# Altium schematic sheet dental-unit-button v1_0.SchDoc
size 840 x 594 mm
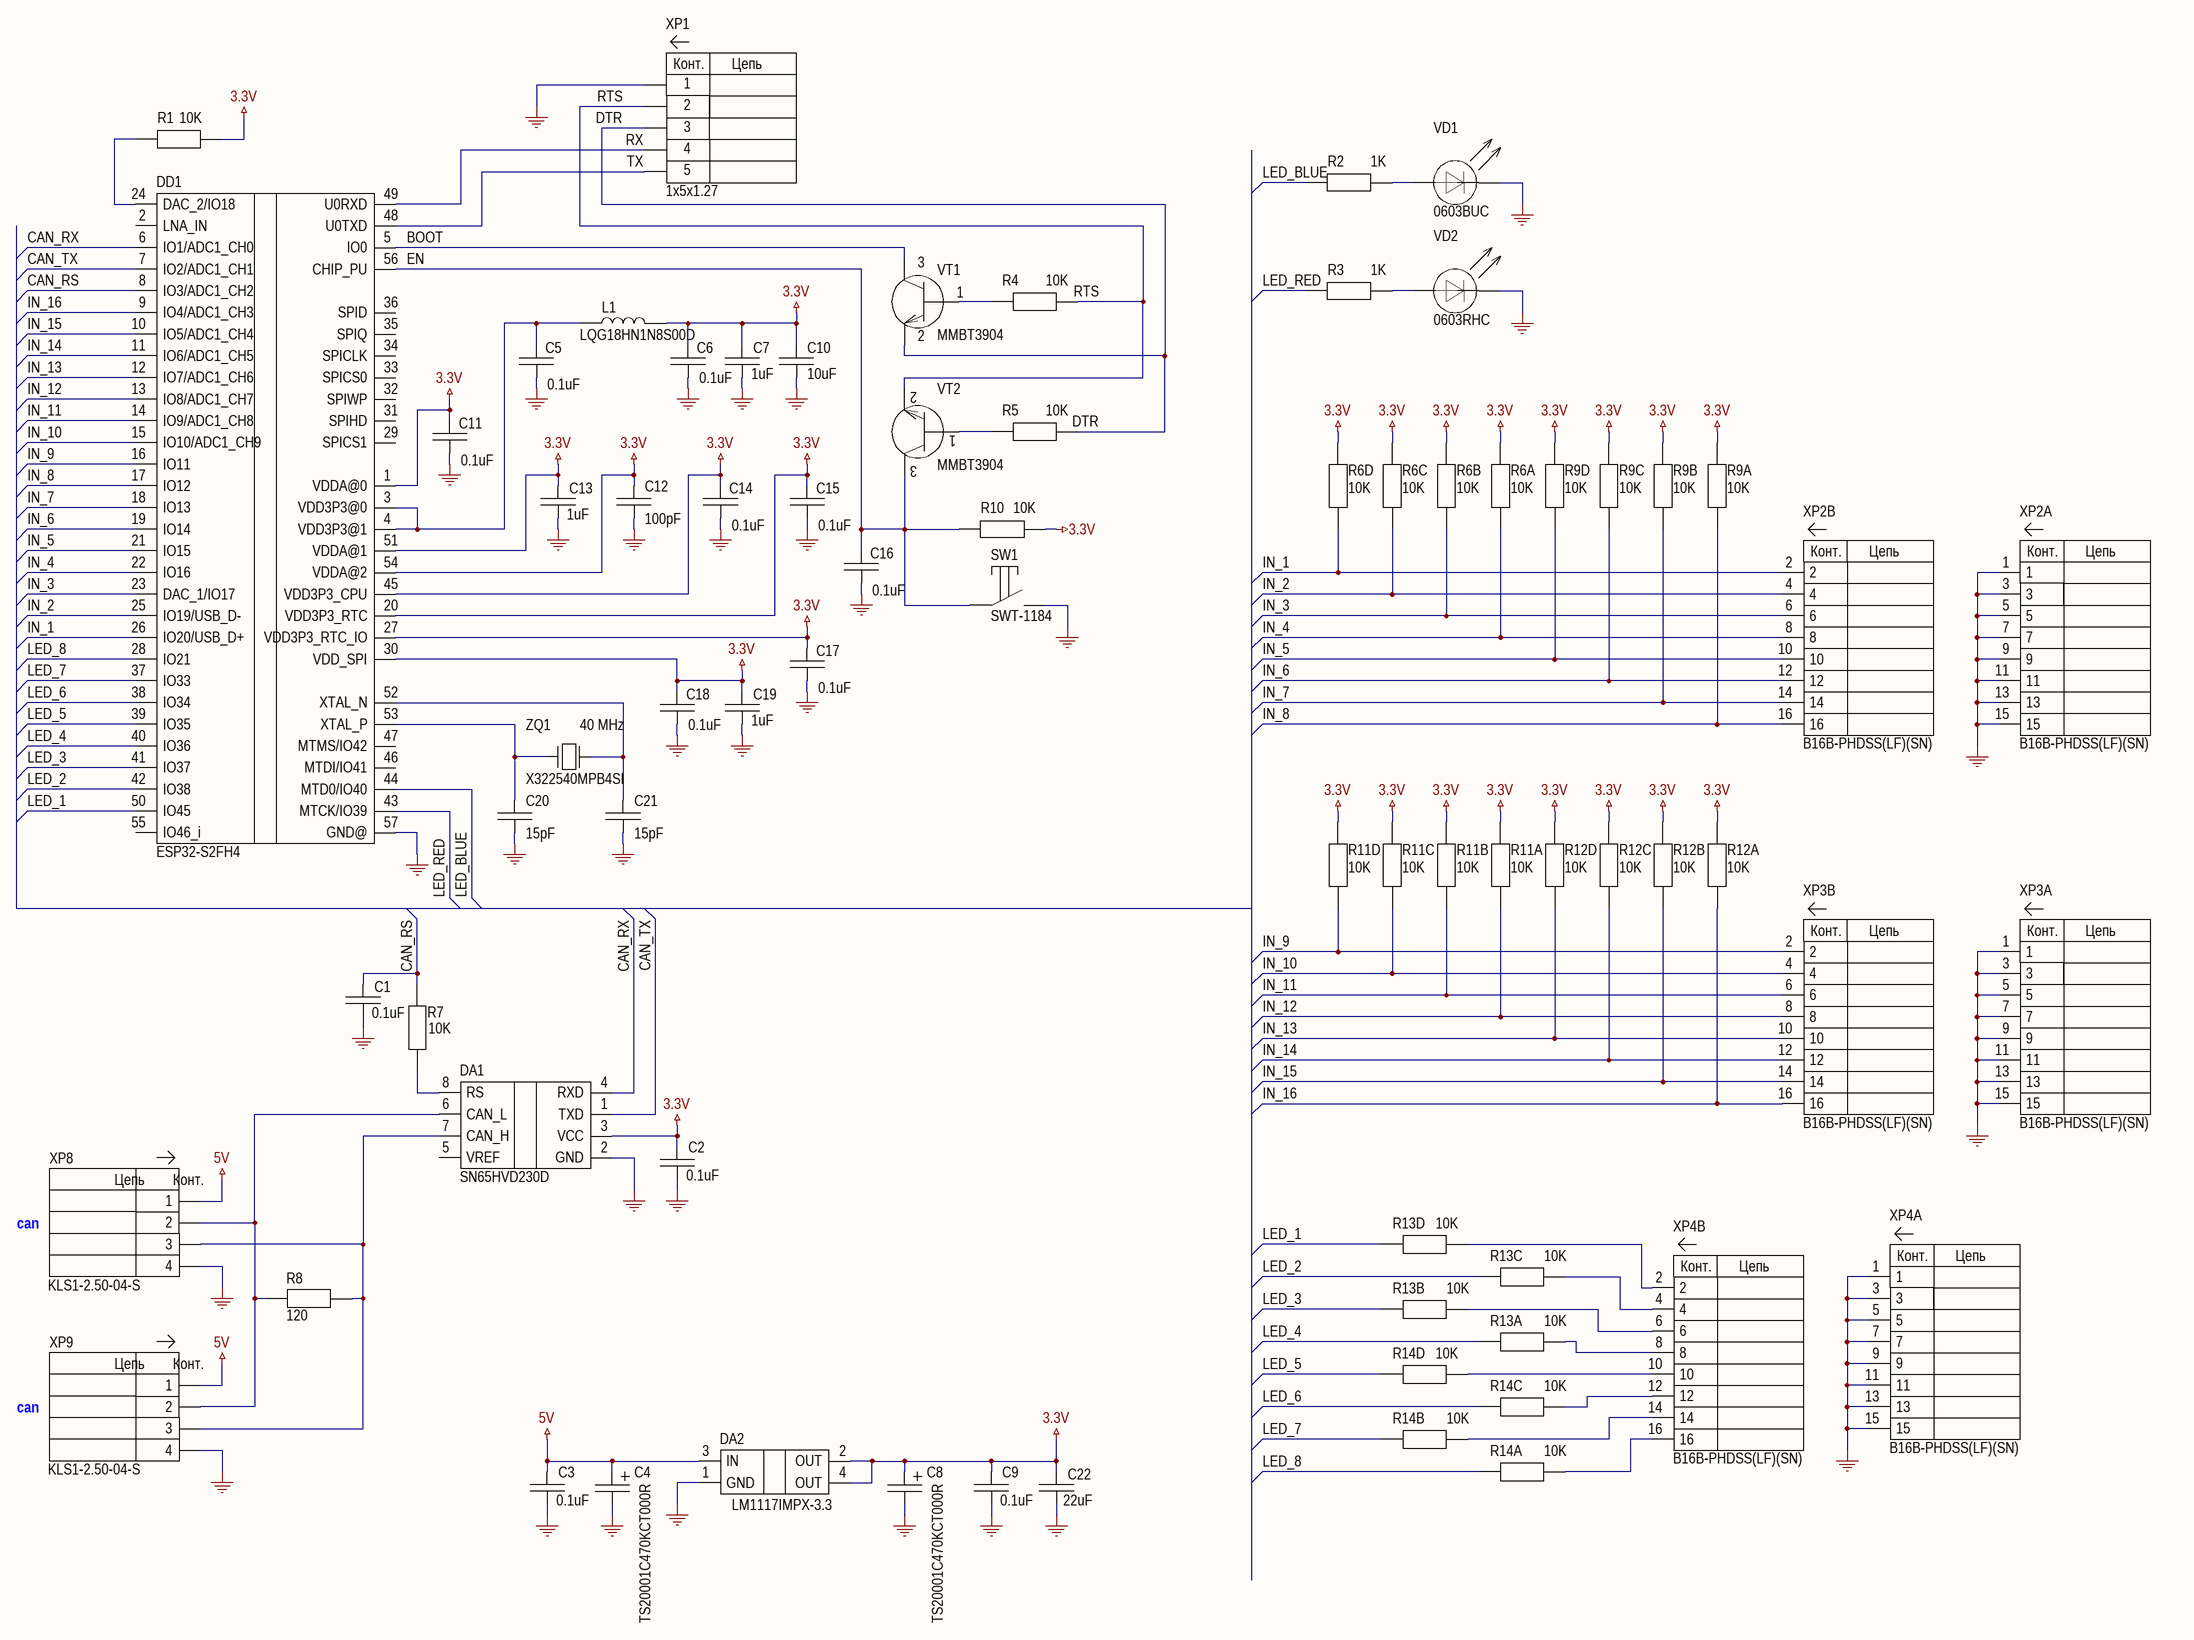
[diagram p0: dental-unit-button v1_0.SchDoc]

## Parts
C1  value 0.1uF  [CC_0603]  (hidden comment: CC0603KRX7R5BB104)
C2  value 0.1uF  [CC_0603]  (hidden comment: CC0603KRX7R5BB104)
C3  value 0.1uF  [CC_0603]  (hidden comment: CC0603KRX7R5BB104)
C4  TS20001C470KCT000R  [CC_TANT_C]
C5  value 0.1uF  [CC_0603]  (hidden comment: CC0603KRX7R5BB104)
C6  value 0.1uF  [CC_0603]  (hidden comment: CC0603KRX7R5BB104)
C7  value 1uF  [CC_0603]  (hidden comment: CL10A105KB8NNNC)
C8  TS20001C470KCT000R  [CC_TANT_C]
C9  value 0.1uF  [CC_0603]  (hidden comment: CC0603KRX7R5BB104)
C10  value 10uF  [CC_0603]  (hidden comment: CL10A106KP8NNNC)
C11  value 0.1uF  [CC_0603]  (hidden comment: CC0603KRX7R5BB104)
C12  value 100pF  [CC_0603]  (hidden comment: CC0603FRNPO9BN101)
C13  value 1uF  [CC_0603]  (hidden comment: CL10A105KB8NNNC)
C14  value 0.1uF  [CC_0603]  (hidden comment: CC0603KRX7R5BB104)
C15  value 0.1uF  [CC_0603]  (hidden comment: CC0603KRX7R5BB104)
C16  value 0.1uF  [CC_0603]  (hidden comment: CC0603KRX7R5BB104)
C17  value 0.1uF  [CC_0603]  (hidden comment: CC0603KRX7R5BB104)
C18  value 0.1uF  [CC_0603]  (hidden comment: CC0603KRX7R5BB104)
C19  value 1uF  [CC_0603]  (hidden comment: CL10A105KB8NNNC)
C20  value 15pF  [CC_0603]  (hidden comment: CC0603GPNPO9BN150)
C21  value 15pF  [CC_0603]  (hidden comment: CC0603GPNPO9BN150)
C22  value 22uF  [CC_0805]  (hidden comment: GRM21BR60J226ME39L)
DA1  SN65HVD230D  [SOIC-8]
DA2  LM1117IMPX-3.3  [SOT-223]
DD1  ESP32-S2FH4  [QFN40P700X700X90-57T400N]
L1  LQG18HN1N8S00D  [IC_0603]
R1  value 10K  [RC_0603]  (hidden comment: AC0603FR-0710KL)
R2  value 1K  [RC_0603]  (hidden comment: AC0603FR-071KL)
R3  value 1K  [RC_0603]  (hidden comment: AC0603FR-071KL)
R4  value 10K  [RC_0603]  (hidden comment: AC0603FR-0710KL)
R5  value 10K  [RC_0603]  (hidden comment: AC0603FR-0710KL)
R6  value 10K  [RC_0603x4]  (hidden comment: YC164-JR-0710KL)  (parts A,B,C,D of 4)
R7  value 10K  [RC_0603]  (hidden comment: AC0603FR-0710KL)
R8  value 120  [RC_0603]  (hidden comment: RC0603FR-07120RL)
R9  value 10K  [RC_0603x4]  (hidden comment: YC164-JR-0710KL)  (parts A,B,C,D of 4)
R10  value 10K  [RC_0603]  (hidden comment: AC0603FR-0710KL)
R11  value 10K  [RC_0603x4]  (hidden comment: YC164-JR-0710KL)  (parts A,B,C,D of 4)
R12  value 10K  [RC_0603x4]  (hidden comment: YC164-JR-0710KL)  (parts A,B,C,D of 4)
R13  value 10K  [RC_0603x4]  (hidden comment: YC164-JR-0710KL)  (parts A,B,C,D of 4)
R14  value 10K  [RC_0603x4]  (hidden comment: YC164-JR-0710KL)  (parts A,B,C,D of 4)
SW1  SWT-1184  [IT-1184]
VD1  0603BUC  [LED_0603]
VD2  0603RHC  [LED_0603]
VT1  MMBT3904  [SOT-23-3]
VT2  MMBT3904  [SOT-23-3]
XP1  1x5x1.27  [XT_1x5x1.27_offset]
XP2  B16B-PHDSS(LF)(SN)  [B16B-PHDSS]  (parts A,B of 2)
XP3  B16B-PHDSS(LF)(SN)  [B16B-PHDSS]  (parts A,B of 2)
XP4  B16B-PHDSS(LF)(SN)  [B16B-PHDSS]  (parts A,B of 2)
XP8  KLS1-2.50-04-S  name: can  [KLS1-2.50-04-S]
XP9  KLS1-2.50-04-S  name: can  [KLS1-2.50-04-S]
ZQ1  X322540MPB4SI  value 40 MHz  [OSC: 3225]

## Nets
3.3V: C2.2 C6.2 C7.2 C8.1 C9.2 C10.2 C11.2 C12.2 C13.2 C14.2 C15.2 C17.2 C18.2 C19.2 C22.2 DA1.3(VCC) DA2.2(OUT) DA2.4(OUT) DD1.1(VDDA@0) DD1.20(VDD3P3_RTC) DD1.27(VDD3P3_RTC_IO) DD1.30(VDD_SPI) DD1.45(VDD3P3_CPU) DD1.51(VDDA@1) DD1.54(VDDA@2) L1.2 R1.2 R6.5 R6.6 R6.7 R6.8 R9.5 R9.6 R9.7 R9.8 R10.2 R11.5 R11.6 R11.7 R11.8 R12.5 R12.6 R12.7 R12.8
5V: C3.2 C4.1 DA2.3(IN) XP8.1 XP9.1
GND: C1.1 C2.1 C3.1 C4.2 C5.1 C6.1 C7.1 C8.2 C9.1 C10.1 C11.1 C12.1 C13.1 C14.1 C15.1 C16.1 C17.1 C18.1 C19.1 C20.1 C21.1 C22.1 DA1.2(GND) DA2.1(GND) DD1.57(GND@) SW1.2 VD1.2(C) VD2.2(C) XP1.1 XP2.1 XP2.3 XP2.5 XP2.7 XP2.9 XP2.11 XP2.13 XP2.15 XP3.1 XP3.3 XP3.5 XP3.7 XP3.9 XP3.11 XP3.13 XP3.15 XP4.1 XP4.3 XP4.5 XP4.7 XP4.9 XP4.11 XP4.13 XP4.15 XP8.4 XP9.4
BOOT: DD1.5(IO0) VT1.3(C)
CAN_RS: C1.2 DD1.8(IO3/ADC1_CH2) R7.2
CAN_RX: DA1.4(RXD) DD1.6(IO1/ADC1_CH0)
CAN_TX: DA1.1(TXD) DD1.7(IO2/ADC1_CH1)
DTR: R5.2 VT1.2(E) XP1.3
EN: C16.2 DD1.56(CHIP_PU) R10.1 SW1.1 VT2.3(C)
IN_1: DD1.26(IO20/USB_D+) R6.4 XP2.2
IN_2: DD1.25(IO19/USB_D-) R6.3 XP2.4
IN_3: DD1.23(DAC_1/IO17) R6.2 XP2.6
IN_4: DD1.22(IO16) R6.1 XP2.8
IN_5: DD1.21(IO15) R9.4 XP2.10
IN_6: DD1.19(IO14) R9.3 XP2.12
IN_7: DD1.18(IO13) R9.2 XP2.14
IN_8: DD1.17(IO12) R9.1 XP2.16
IN_9: DD1.16(IO11) R11.4 XP3.2
IN_10: DD1.15(IO10/ADC1_CH9) R11.3 XP3.4
IN_11: DD1.14(IO9/ADC1_CH8) R11.2 XP3.6
IN_12: DD1.13(IO8/ADC1_CH7) R11.1 XP3.8
IN_13: DD1.12(IO7/ADC1_CH6) R12.4 XP3.10
IN_14: DD1.11(IO6/ADC1_CH5) R12.3 XP3.12
IN_15: DD1.10(IO5/ADC1_CH4) R12.2 XP3.14
IN_16: DD1.9(IO4/ADC1_CH3) R12.1 XP3.16
LED_1: DD1.50(IO45) R13.5
LED_2: DD1.42(IO38) R13.6
LED_3: DD1.41(IO37) R13.7
LED_4: DD1.40(IO36) R13.8
LED_5: DD1.39(IO35) R14.5
LED_6: DD1.38(IO34) R14.6
LED_7: DD1.37(IO33) R14.7
LED_8: DD1.28(IO21) R14.8
LED_BLUE: DD1.44(MTD0/IO40) R2.1
LED_RED: DD1.43(MTCK/IO39) R3.1
RTS: R4.2 VT2.2(E) XP1.2
RX: DD1.49(U0RXD) XP1.4
TX: DD1.48(U0TXD) XP1.5
NetC5_2: C5.2 DD1.3(VDD3P3@0) DD1.4(VDD3P3@1) L1.1
NetC20_2: C20.2 DD1.53(XTAL_P) ZQ1.1
NetC21_2: C21.2 DD1.52(XTAL_N) ZQ1.3
NetDA1_6: DA1.6(CAN_L) R8.2 XP8.2 XP9.2
NetDA1_7: DA1.7(CAN_H) R8.1 XP8.3 XP9.3
NetDA1_8: DA1.8(RS) R7.1
NetDD1_24: DD1.24(DAC_2/IO18) R1.1
NetR2_2: R2.2 VD1.1(A)
NetR3_2: R3.2 VD2.1(A)
NetR4_1: R4.1 VT1.1(B)
NetR5_1: R5.1 VT2.1(B)
NetR13_1: R13.1 XP4.8
NetR13_2: R13.2 XP4.6
NetR13_3: R13.3 XP4.4
NetR13_4: R13.4 XP4.2
NetR14_1: R14.1 XP4.16
NetR14_2: R14.2 XP4.14
NetR14_3: R14.3 XP4.12
NetR14_4: R14.4 XP4.10

Not connected (* = marked no-connect by the designer): DA1 5(VREF); DD1 2(LNA_IN) 29(SPICS1) 31(SPIHD) 32(SPIWP) 33(SPICS0) 34(SPICLK) 35(SPIQ) 36(SPID) 46(MTDI/IO41) 47(MTMS/IO42) 55(IO46_i); ZQ1 2 4

## Notes on the sheet
- Перв. примен.
- Справ. №
- Подп. и дата
- Инв. № дубл.
- Взам. инв. №
- Разраб.
- Изм.
- Лист
- № докум.
- Подп.
- Дата
- Лит.
- Масса
- Масштаб
- Пров.
- Т.контр.
- Листов
- Инв. № подл.
- Утв.
- Н.контр.
- 2.106-A1
- Копировал
- Формат А1
- (in symbol B16B-PHDSS(LF)(SN), part A) Конт.; Цепь
- (in symbol B16B-PHDSS(LF)(SN), part B) Конт.; Цепь
- (in symbol KLS1-2.50-04-x) Цепь; Конт.
- (in symbol XT_1x5x1_27) Конт.; Цепь

## Library data of the parts
C1-C3 C5 C6 C9 C11 C14-C18 = C: Cap Ceramic, 0603, 0.1u, 10%, 16V, X7R (Yageo); type: CC0603KRX7R5BB104
C4 C8 = C_polar: 47uF, 16v, C, 10%, @SUNTAN,; value: 47uF; type: TS20001C470KCT000R
C7 C13 C19 = C: Cap Ceramic, 0603, 1u, 10%, 50V, X5R (Sumsung); type: CL10A105KB8NNNC
C10 = C: Cap Ceramic, 0603, 10u, 10%, 16V, X5R (Sumsung); type: CL10A106KP8NNNC
C12 = C: Cap Ceramic, 0603, 100p, 1%, 50V, NP0 (Yageo); type: CC0603FRNPO9BN101
C20 C21 = C: Cap Ceramic, 0603, 15pF, 50V, NP0 (Yageo); type: CC0603GPNPO9BN150
C22 = C: Cap Ceramic, 0805, 22u, 20%, 6.3V, X5R, -55 +85C (Murata); type: GRM21BR60J226ME39L
DA1 = SN65HVD230D: 3.3-V CAN TRANSCEIVERS, @TI; type: SN65HVD230D; ComponentLink1Description: link; ComponentLink1URL: https://www.elitan.ru/pdf/0/1/8/5/1/01851789.pdf
DA2 = LM1117IMPX-3.3: LDO, 3.3v, 0.8A, SOT-223, Texas Instruments; type: LM1117S-3.3
DD1 = ESP32-S2: SMD WI-FI IC, ESP32-S2FH4, SINGAL-C; MF: Espressif Systems; Value: ESP32-S2; Package: None; Price: None; MP: ESP32-S2; Availability: Unavailable; SnapEDA_Link: https://www.snapeda.com/parts/ESP32-S2/Espressif%20Systems/view-part/4571535/?ref=snap; ComponentLink1Description: link; ComponentLink1URL: https://www.espressif.com/sites/default/files/documentation/esp32-s2_datasheet_en.pdf
L1 = L: 1.1A, 1.8nH,100mΩ, 0603, Inductors (SMD), @MURATA; type: 0603; value: LQG18HN1N8S00D
R1 R4 R5 R7 R10 = R: Res, 0603, 10K, 1%, 0.25W (ф. Yageo); type: AC0603FR-0710KL; power: 0.25W
R2 R3 = R: Res, 0603, 1K 1%, 0.25W (ф. Yageo); type: AC0603FR-071KL; power: 0.25W
R6 R9 R11-R14 = R_Array: Res, 0603x4, 10K, 5%, 0.25W (ф. Yageo); type: YC164-JR-0710KL; power: 0.25W
R8 = R: Res, 0603, 120, 1%, 0.25W (ф. Yageo); type: RC0603FR-07120RL; power: 0.25W
SW1 = smd-side-push-button
VD1 = LED: Led, 0603, BLUE, 20mA, 125, 140MCD, CPMELEC
VD2 = LED: Led, 0603, RED, 20mA, 125, 140MCD, CPMELEC
VT1 VT2 = N-P-N-SOT-23: type: MMBT3904
XP1 = XT_1x5x1_27: type: 1x5x1.27
XP8 XP9 = KLS1-2.50-04-x: 2.5mm, 4pin, KLS; ComponentLink1Description: link; ComponentLink1URL: https://www.triatron.ru/upload/catalog_photo/elements/pdf/212764.pdf
ZQ1 = OSC 3225: 40MHz, 15pF, ±10ppm, SMD3225-4P, Crystals ROHS, @YXC; type: X322540MPB4SI
XP2-XP4 = B16B-PHDSS(LF)(SN): type: B16B-PHDSS(LF)(SN)